# Altium project THE_FIRST.PrjPcb (part 2 of 2)

## Sheet BUFFER_BTOA.SchDoc
size A4; SheetNumber: 9; SheetTotal: 9
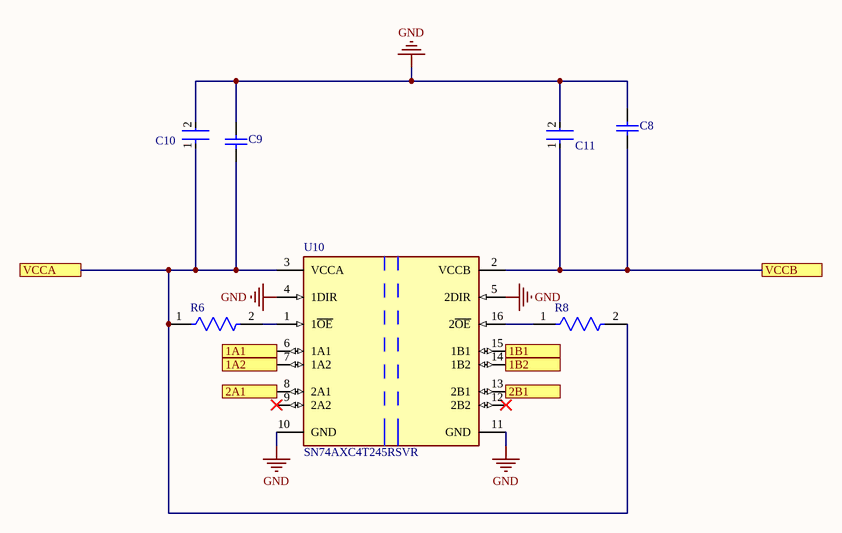
[diagram p11: BUFFER_BTOA.SchDoc]

### Parts
C8  CAP 1uF 16V 0805(2012)  [CAPC0805(2012)100_N]  (value not drawn)
C9  CAP 1uF 16V 0805(2012)  [CAPC0805(2012)100_N]  (value not drawn)
C10  C0805C104K4RAC  [FP-C0805C-DN-MFG]  (value not drawn)
C11  C0805C104K4RAC  [FP-C0805C-DN-MFG]  (value not drawn)
R6  RC0603FR-0710KL  [FP-RC0603-0_55-IPC_C]  (value not drawn)
R8  RC0603FR-0710KL  [FP-RC0603-0_55-IPC_C]  (value not drawn)
U10  SN74AXC4T245RSVR  [FP-RSV0016A-MFG]

### Ports
1A1 (see THE_FIRST[3D]), 1A2 (see THE_FIRST[3D]), 1B1 (see THE_FIRST[4D]), 1B2 (see THE_FIRST[4D]), 2A1 (see THE_FIRST[3D]), 2B1 (see THE_FIRST[4D]), VCCA (see THE_FIRST[3C], BUFFER_ATOB[2B]), VCCB (see THE_FIRST[4C], BUFFER_ATOB[3B])

### Nets
GND: C8.2 C9.2 C10.2 C11.2 U10.4(1DIR) U10.5(2DIR) U10.10(GND) U10.11(GND)
SC1A: U10.6(1A1) ; port 1A1
SC1B: U10.13(2B1) ; port 2B1
SC2A: U10.7(1A2) ; port 1A2
SC2B: U10.15(1B1) ; port 1B1
SC3A: U10.8(2A1) ; port 2A1
SC3B: U10.14(1B2) ; port 1B2
VDD1.1: C9.1 C10.1 R6.1 R8.2 U10.3(VCCA) ; port VCCA
VDD3.3_fpga: C8.1 C11.1 U10.2(VCCB) ; port VCCB
NetR6_2: R6.2 U10.1(1~{OE})
NetR8_1: R8.1 U10.16(2~{OE})

Not connected (* = marked no-connect by the designer): U10 9(2A2)* 12(2B2)*

### Library data of the parts
C8 C9 = CMP-1036-04747-1: CAP 1uF 16V ±10% 0805 (2012 Metric) Thickness 1mm SMD; Manufacturer: KEMET; Manufacturer Part Number: C0805C105K4RACTU; Tolerance: Â±10%; Case-Metric: 2012; Case-EIA: 0805; Dielectric Material: Ceramic; Multilayer: Yes; Temperature Characteristics Code: X7R; Technology: SMT; Value: 1uF; Rated Voltage: 16 V; Max Thickness: 1 mm; Supplier: Digikey; Supplier Part Number: 399-C0805C105K4RACTUCT-ND; RoHS: Yes; Category: Ceramic Capacitors; Stock: 418697; Pricing: 1=0.12, 10=0.068, 100=0.041, 1000=0.03184 (USD); Mounting Technology: Surface Mount; Pins: 2; Package Shape: Rectangular; Case/Package: 0805; Terminal Finish: Nickel; Min Operating Temperature: -55°C; Max Operating Temperature: 125°C; Capacitor Type: Ceramic; Tolerance  (fill in as +-): 10%; Package Style: SMTMeter; Packaging: Tape and Reel; Tolerance (fill in as +-): 10%; Rated DC Voltage (URdc): 16V; Termination: Wraparound; JESD-609 Code: e3; Length: 2mm; Width: 1.25mm; Height: 0.9mm; Reach SVHC Compliant: Yes; RoHS Compliant: Yes; ComponentLink1URL: https://datasheet.ciiva.com:443/pdfs/VipMasterIC/IC/KEME/KEME-S-A0008991654/KEME-S-A0008991654-1.pdf?src-supplier=IHS+Markit; ComponentLink1Description: https://datasheet.ciiva.com:443/pdfs/VipMasterIC/IC/KEME/KEME-S-A0008991654/KEME-S-A0008991654-1.pdf?src-supplier=IHS+Markit
C10 C11 = CMP-03020-009592-2: C0805 0.10 μF X7R 30ppm/°C 10.00% 16 V; Manufacturer: KEMET; Material: Ceramic; Capacitance: 0.10 μF; Tolerance: 0.1; Value: 0.10 μF; Voltage Rating: 16 V; ComponentLink2Description: Datasheet; Category: Cap; Package: C0805C-DN; Device Class L1: Passive Components; Device Class L3: Ceramic Capacitors; RoHS: TRUE; Height: 0.88mm; Automotive: No; Temperature Range High: +125°C; Octopart: https://octopart.com/c0805c104k4rac-kemet-1343167; Mouser Description: Cap Ceramic 0.1uF 16V X7R 10% Pad SMD 0805 125C Bulk; Lead Free: Yes; Temperature Coefficient: 30ppm/°C; Ipc Land Pattern Name: CAPC200125X78; Manufacturer Part Number: C0805C104K4RAC; Temperature Characteristic: X7R; Device Class L2: Capacitors; Temperature Range Low: -55°C; Temperature: -55°C to +125°C; ComponentLink2URL: https://content.kemet.com/datasheets/KEM_C1003_C0G_SMD.pdf
R6 R8 = CMP-2100-03664-2: RES 10K OHM 1% 1/10W 0603; Manufacturer: Yageo; Voltage Rating: 75V; Voltage Rating (DC): 50V; Resistance: 10kR; Power Rating: 100mW; Temperature Coefficient: 100ppm/°C; Value: 10kR; Rated Temperature: 70°C; Temperature Coefficient (ppm/Cel): 100; Additional Feature: LASER TRIMMABLE; Package Height: 0.45mm; Package Length: 1.6mm; Package Width: 0.8mm; Depth: 0.8mm; Termination: SMD/SMT; Resistor Type: Thick Film; Series: RC; Construction: Rectangular; Features: Moisture Resistant; Packaging: Tape and Reel; Min Operating Temperature: -55°C; Number of Terminations: 2; Lead Pitch: 0.3mm; RoHS Compliant: Yes; Case/Package: 0603; Resistance Tolerance: 1%; Military Standard: Not; Weight: 7.1E-05oz; Number of Pins: 2; Tolerance: 1%; Length: 1.6mm; Case Code (Imperial): 0603; Lead Free: Lead Free; Width: 0.8mm; Max Power Dissipation: 100mW; Height: 0.45mm; Max Operating Temperature: 155°C; Case Code (Metric): 1608; Size Code: 0603; Supplier: Digikey; Supplier Part Number: 311-10.0KHRDKR-ND; Manufacturer Part Number: RC0603FR-0710KL; RoHS: Yes; Category: Chip SMD Resistors; Stock: 3719141; Pricing: 1=0.1, 10=0.009, 100=0.0071, 1000=0.0051 (USD); Mounting Technology: Surface Mount; Pins: 2; Terminal Finish: Nickel; Package Shape: Rectangular; JESD-609 Code: e3; Technology: METAL GLAZE/THICK FILM; Power: 100mW; Working Voltage: 75V; Reach SVHC Compliant: Yes; ComponentLink1URL: https://datasheet.ciiva.com:443/pdfs/VipMasterIC/IC/YAGO/YAGO-S-A0008145938/YAGO-S-A0008145938-1.pdf?src-supplier=IHS+Markit; ComponentLink1Description: https://datasheet.ciiva.com:443/pdfs/VipMasterIC/IC/YAGO/YAGO-S-A0008145938/YAGO-S-A0008145938-1.pdf?src-supplier=IHS+Markit
U10 = CMP-04899-000112-1: IC TRANSLATION TXRX 3.6V 16UQFN; Manufacturer: Texas Instruments; Supplier: Arrow Electronics; Supplier Part Number: SN74AXC4T245RSVR; Manufacturer Part Number: SN74AXC4T245RSVR; RoHS: Yes; Category: Buffers, Drivers and Transceivers; Stock: 1553; Pricing: 1=0.545, 10=0.4644, 25=0.4374, 100=0.405, 250=0.3871, 500=0.3731, 1000=0.3485 (USD); ComponentLink1URL: https://www.ti.com:443/lit/ds/symlink/sn74axc4t245.pdf?src-supplier=IHS+Markit; ComponentLink1Description: https://www.ti.com:443/lit/ds/symlink/sn74axc4t245.pdf?src-supplier=IHS+Markit; ComponentLink2URL: http://www.ti.com/general/docs/suppproductinfo.tsp?distId=10&amp;gotoUrl=http%3A%2F%2Fwww.ti.com%2Flit%2Fgpn%2Fsn74axc4t245&src-supplier=Digikey; ComponentLink2Description: http://www.ti.com/general/docs/suppproductinfo.tsp?distId=10&amp;gotoUrl=http%3A%2F%2Fwww.ti.com%2Flit%2Fgpn%2Fsn74axc4t245&src-supplier=Digikey

## Nets that join several sheets
GND: THE_FIRST (69 pins), U_ldo1 (9 pins), U_ldo2 (9 pins), U_ldo3 (9 pins), U_ldo4 (9 pins), U_ldo5 (9 pins), U_ldo6 (9 pins), U_ldo7 (9 pins), U_ldo8 (9 pins), U_DP1 (U9A.8 U9A.18), U_DP2 (U9B.8 U9B.18), U_DP101 (10 pins), U_DP102 (6 pins), U_LDO3.31 (11 pins), U_LDO3.32 (11 pins), ldo1.1 (10 pins), BUFFER_ATOB (5 pins), BUFFER_BTOA (8 pins)
CLK1: THE_FIRST (U2.JP1_1), U_DP2 (U9B.12), U_DP102 (U3B.12)
CLK2: THE_FIRST (U2.JP1_34), U_DP1 (U9A.12), U_DP101 (U3A.12)
CSA1: THE_FIRST (U2.JP1_4), U_DP2 (U9B.13), U_DP102 (U3B.13)
CSA2: THE_FIRST (U2.JP1_26), U_DP1 (U9A.13), U_DP101 (U3A.13)
DOUT1A: THE_FIRST (J37.1), BUFFER_ATOB (U8.8)
DOUT1B: THE_FIRST (U2.JP2_14), BUFFER_ATOB (U8.5)
OUT1: THE_FIRST (J34.2 R2.2), U_DP2 (U9B.16)
OUT2: THE_FIRST (J35.2 R1.2), U_DP1 (U9A.16)
RC1: U_lm334sm1 (U1A.2), U_DP101 (U3A.2)
RC2: U_lm334sm2 (U1B.2), U_DP101 (U3A.23)
RC3: U_lm334sm3 (U1C.2), U_DP101 (U3A.5)
RC4: U_lm334sm4 (U1D.2), U_DP101 (U3A.20)
RESETA1: THE_FIRST (U2.JP1_6), U_DP2 (U9B.14), U_DP102 (U3B.14)
RESETA2: THE_FIRST (U2.JP1_28), U_DP1 (U9A.14), U_DP101 (U3A.14)
ResH1: THE_FIRST (P2.3), U_DP102 (U3B.2)
ResH2: THE_FIRST (P1.3), U_DP102 (U3B.20)
ResH3: THE_FIRST (P4.3), U_DP102 (U3B.5)
ResH4: THE_FIRST (P3.3), U_DP102 (U3B.23)
ResL1: U_ldo1 (R8_12.6kA.2 U4A.3), U_DP1 (U9A.1 U9A.3)
ResL2: U_ldo2 (R8_12.6kB.2 U4B.3), U_DP1 (U9A.22 U9A.24)
ResL3: U_ldo3 (R8_12.6kC.2 U4C.3), U_DP1 (U9A.4 U9A.6)
ResL4: U_ldo4 (R8_12.6kD.2 U4D.3), U_DP1 (U9A.19 U9A.21)
ResL5: U_ldo5 (R8_12.6kE.2 U4E.3), U_DP2 (U9B.1 U9B.3)
ResL6: U_ldo6 (R8_12.6kF.2 U4F.3), U_DP2 (U9B.22 U9B.24)
ResL7: U_ldo7 (R8_12.6kG.2 U4G.3), U_DP2 (U9B.4 U9B.6)
ResL8: U_ldo8 (R8_12.6kH.2 U4H.3), U_DP2 (U9B.19 U9B.21)
SC1A: THE_FIRST (J38.1), BUFFER_BTOA (U10.6)
SC1B: THE_FIRST (U2.JP2_3), BUFFER_BTOA (U10.13)
SC2A: THE_FIRST (J12.1), BUFFER_BTOA (U10.7)
SC2B: THE_FIRST (U2.JP2_9), BUFFER_BTOA (U10.15)
SC3A: THE_FIRST (J36.1), BUFFER_BTOA (U10.8)
SC3B: THE_FIRST (U2.JP2_7), BUFFER_BTOA (U10.14)
SDI1: THE_FIRST (U2.JP1_2), U_DP102 (U3B.11)
SDI2: THE_FIRST (U2.JP1_32), U_DP101 (U3A.11)
SDO1: THE_FIRST (R4.2), U_DP2 (U9B.11), U_DP102 (U3B.16)
SDO2: THE_FIRST (R3.2), U_DP1 (U9A.11), U_DP101 (U3A.16)
VDD: THE_FIRST (C1.1 C2.2 J1.1), U_ldo1 (6 pins), U_ldo2 (6 pins), U_ldo3 (6 pins), U_ldo4 (6 pins), U_ldo5 (6 pins), U_ldo6 (6 pins), U_ldo7 (6 pins), U_ldo8 (6 pins), U_DP1 (U9A.7 U9A.9 U9A.15), U_DP2 (U9B.7 U9B.9 U9B.15), U_lm334sm1 (U1A.3), U_lm334sm2 (U1B.3), U_lm334sm3 (U1C.3), U_lm334sm4 (U1D.3), U_DP101 (U3A.7 U3A.9 U3A.15), U_DP102 (U3B.7 U3B.9 U3B.15), U_LDO3.31 (6 pins), U_LDO3.32 (6 pins), ldo1.1 (6 pins)
VDD1.1: ldo1.1 (7 pins), BUFFER_ATOB (6 pins), BUFFER_BTOA (5 pins)
VDD3.3_fpga: THE_FIRST (U2.JP1_29), BUFFER_ATOB (C13.1 C15.1 U8.6), BUFFER_BTOA (C8.1 C11.1 U10.2)
VDD3.31: THE_FIRST (R2.1 R4.1), U_DP2 (U9B.10), U_DP102 (U3B.10), U_LDO3.31 (7 pins)
VDD3.32: THE_FIRST (R1.1 R3.1), U_DP1 (U9A.10), U_DP101 (U3A.10), U_LDO3.32 (7 pins)
Vneg1: THE_FIRST (J16.2), U_lm334sm1 (U1A.1)
Vneg2: THE_FIRST (J17.2), U_lm334sm2 (U1B.1)
Vneg3: THE_FIRST (J18.2), U_lm334sm3 (U1C.1)
Vneg4: THE_FIRST (J19.2), U_lm334sm4 (U1D.1)
Vout1: THE_FIRST (J2.2 J7.2), U_ldo1 (6 pins), U_DP1 (U9A.2)
Vout2: THE_FIRST (J3.2 J8.2), U_ldo2 (6 pins), U_DP1 (U9A.23)
Vout3: THE_FIRST (J4.2 J11.2), U_ldo3 (6 pins), U_DP1 (U9A.5)
Vout4: THE_FIRST (J6.2 J14.2), U_ldo4 (6 pins), U_DP1 (U9A.20)
Vout5: THE_FIRST (J9.2 P2.2), U_ldo5 (6 pins), U_DP2 (U9B.2)
Vout6: THE_FIRST (J15.2 P1.2), U_ldo6 (6 pins), U_DP2 (U9B.23)
Vout7: THE_FIRST (J20.2 P3.2), U_ldo7 (6 pins), U_DP2 (U9B.5)
Vout8: THE_FIRST (J21.2 P4.2), U_ldo8 (6 pins), U_DP2 (U9B.20)
Voutr1: THE_FIRST (J5.2 J22.2), U_DP102 (U3B.19)
Voutr2: THE_FIRST (J10.2 J23.2), U_DP102 (U3B.3)
Voutr3: THE_FIRST (J13.2 J24.2), U_DP102 (U3B.22)
Voutr4: THE_FIRST (J25.2 J28.2), U_DP102 (U3B.6)